# EAGLE design Helicopter Control Board (EAGLE 6.5.1)
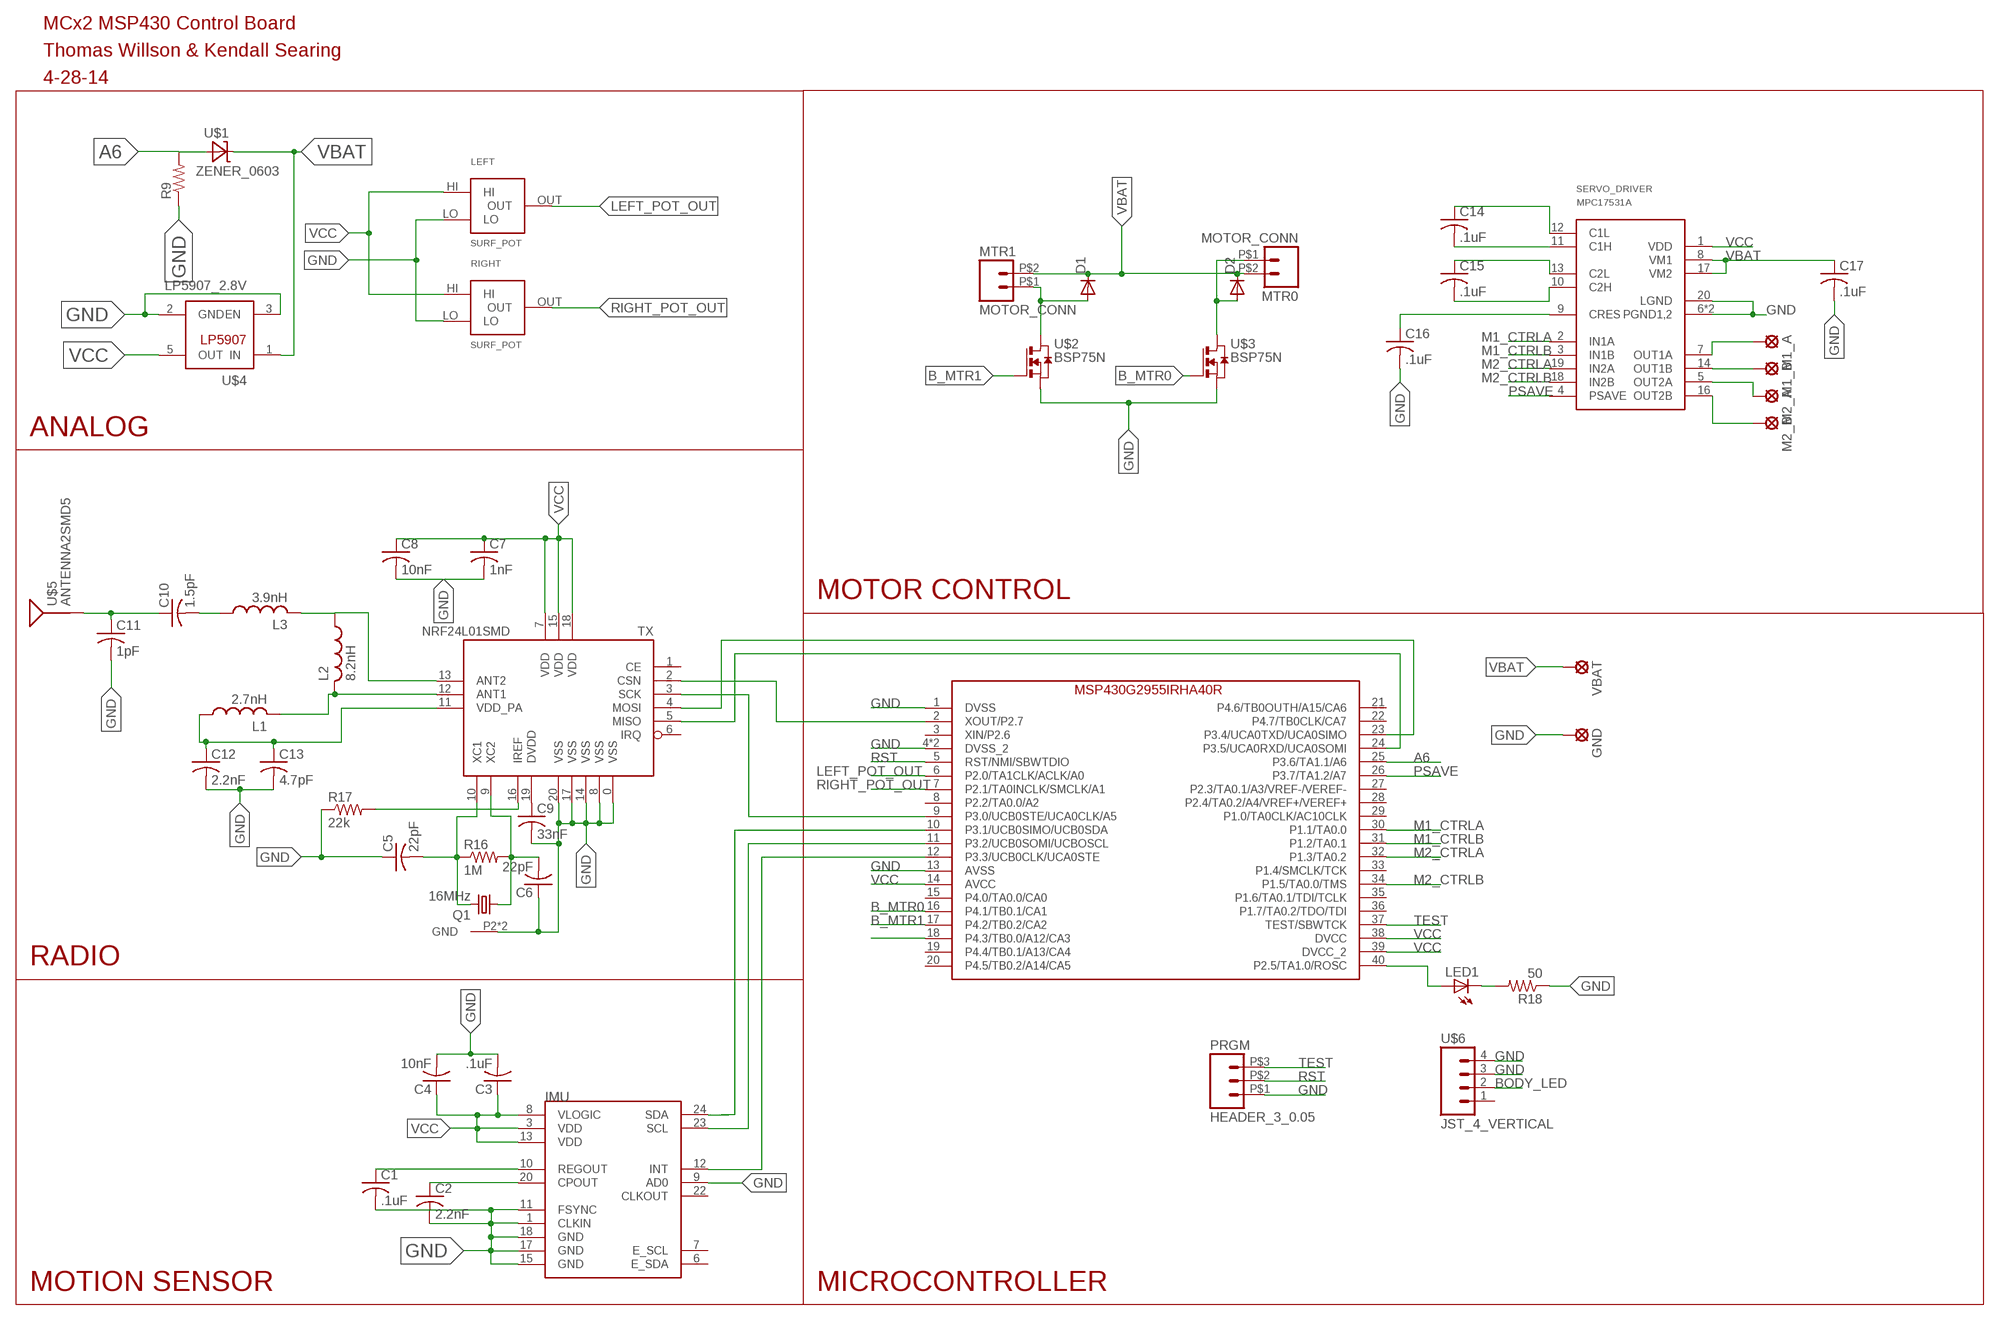
[diagram p0: schematic, sheet 1]

## Parts
C1  .1uF  C-USC0402  [C0402]
C2  2.2nF  C-USC0402  [C0402]
C3  .1uF  C-USC0402  [C0402]
C4  10nF  C-USC0402  [C0402]
C5  22pF  C-USC0402  [C0402]
C6  22pF  C-USC0402  [C0402]
C7  1nF  C-USC0402  [C0402]
C8  10nF  C-USC0402  [C0402]
C9  33nF  C-USC0402  [C0402]
C10  1.5pF  C-USC0402  [C0402]
C11  1pF  C-USC0402  [C0402]
C12  2.2nF  C-USC0402  [C0402]
C13  4.7pF  C-USC0402  [C0402]
C14  .1uF  C-USC0402  [C0402]
C15  .1uF  C-USC0402  [C0402]
C16  .1uF  C-USC0402  [C0402]
C17  .1uF  C-USC0402  [C0402]
D1  DIODESMA  [SMA-DIODE]
D2  DIODESMA  [SMA-DIODE]
GND  LSP10  [LSP10]
IMU  MPU-9150QFN-24-NP  [QFN-24-NP]
L1  2.7nH  L-US  [R0402]
L2  8.2nH  L-US  [R0402]
L3  3.9nH  L-US  [R0402]
LED1  LED-BLUE0603  [LED-0603]
LEFT  SURF_POT  [SURF_POT]
M1_A  LSP10  [LSP10]
M1_B  LSP10  [LSP10]
M2_A  LSP10  [LSP10]
M2_B  LSP10  [LSP10]
MTR0  MOTOR_CONN  [MOTOR_CONN]
MTR1  MOTOR_CONN  [MOTOR_CONN]
PRGM  HEADER_3_0.05  [HEADER_3_.05]
Q1  16MHz  CRYSTAL_16MHZ_12PF_SMD  [TXC-4SMD]
R9  R-US_R0402  [R0402]
R16  1M  R-US_R0402  [R0402]
R17  22k  R-US_R0402  [R0402]
R18  50  R-US_R0603  [R0603]
RIGHT  SURF_POT  [SURF_POT]
SERVO_DRIVER  MPC17531A  [SSOP_20]
TX  NRF24L01SMD  [QFN20]
U$1  ZENER_0603  [ZENER_0603]
U$2  BSP75N  [PG-SOT-223]
U$3  BSP75N  [PG-SOT-223]
U$4  LP5907_2.8V  LP5907  [SOT23-DBV]
U$5  ANTENNA2SMD5  [ANTENNA-CHIP5]
U$6  JST_4_VERTICAL  [JST-4-SMD-VERT-1.0MM]
U$8  G2955IRHA40R  [RHA40]
VBAT  LSP10  [LSP10]

## Nets
A6: R9.2 U$1.A U$8.25(P3.6/TA1.1/A6)
B_MTR0: U$3.1(G) U$8.16(P4.1/TB0.1/CA1)
B_MTR1: U$2.1(G) U$8.17(P4.2/TB0.2/CA2)
BODY_LED: U$6.2 U$8.18(P4.3/TB0.0/A12/CA3)
GND: C1.2 C2.2 C3.2 C4.2 C5.1 C6.1 C7.2 C8.2 C9.2 C11.2 C12.2 C13.2 C16.2 C17.2 GND.MP IMU.1(CLKIN) IMU.9(AD0) IMU.11(FSYNC) IMU.15(GND) IMU.17(GND) IMU.18(GND) LEFT.LO PRGM.P$1 Q1.P2(GND) Q1.P4(GND) R9.1 R17.1 R18.1 RIGHT.LO SERVO_DRIVER.6(PGND1,2) SERVO_DRIVER.15(PGND1,2) SERVO_DRIVER.20(LGND) TX.0(VSS) TX.8(VSS) TX.14(VSS) TX.17(VSS) TX.20(VSS) U$2.3(S) U$2.4(S) U$3.3(S) U$3.4(S) U$4.2(GND) U$4.3(EN) U$6.3 U$6.4 U$8.1(DVSS) U$8.4(DVSS_2) U$8.13(AVSS) U$8.TP(DVSS_2)
LEFT_POT_OUT: LEFT.OUT U$8.6(P2.0/TA1CLK/ACLK/A0)
M1_CTRLA: SERVO_DRIVER.2(IN1A) U$8.30(P1.1/TA0.0)
M1_CTRLB: SERVO_DRIVER.3(IN1B) U$8.31(P1.2/TA0.1)
M2_CTRLA: SERVO_DRIVER.19(IN2A) U$8.32(P1.3/TA0.2)
M2_CTRLB: SERVO_DRIVER.18(IN2B) U$8.34(P1.5/TA0.0/TMS)
N$1: M1_A.MP SERVO_DRIVER.7(OUT1A)
N$3: M1_B.MP SERVO_DRIVER.14(OUT1B)
N$4: TX.3(SCK) U$8.9(P3.0/UCB0STE/UCA0CLK/A5)
N$5: TX.4(MOSI) U$8.23(P3.4/UCA0TXD/UCA0SIMO)
N$6: TX.5(MISO) U$8.24(P3.5/UCA0RXD/UCA0SOMI)
N$7: M2_A.MP SERVO_DRIVER.5(OUT2A)
N$8: IMU.12(INT) U$8.12(P3.3/UCB0CLK/UCA0STE)
N$9: IMU.23(SCL) U$8.11(P3.2/UCB0SOMI/UCBOSCL)
N$10: C1.1 IMU.10(REGOUT)
N$11: C2.1 IMU.20(CPOUT)
N$12: M2_B.MP SERVO_DRIVER.16(OUT2B)
N$13: C14.1 SERVO_DRIVER.12(C1L)
N$14: C14.2 SERVO_DRIVER.11(C1H)
N$15: C15.1 SERVO_DRIVER.13(C2L)
N$17: C10.2 L3.1
N$18: D1.A MTR1.P$1 U$2.2(D)
N$19: D2.A MTR0.P$1 U$3.2(D)
N$20: IMU.24(SDA) U$8.10(P3.1/UCB0SIMO/UCB0SDA)
N$21: C6.2 Q1.P1 R16.2
N$22: C5.2 Q1.P3 R16.1 TX.10(XC1)
N$23: C9.1 TX.19(DVDD)
N$24: R17.2 TX.16(IREF)
N$25: L1.2 L2.2 TX.12(ANT1)
N$26: C12.1 C13.1 L1.1 TX.11(VDD_PA)
N$27: L2.1 L3.2 TX.13(ANT2)
N$28: C10.1 C11.1 U$5.FEED(SIGNAL)
N$29: TX.2(CSN) U$8.2(XOUT/P2.7)
N$30: C15.2 SERVO_DRIVER.10(C2H)
N$31: LED1.A U$8.40(P2.5/TA1.0/ROSC)
N$32: LED1.C R18.2
N$33: C16.1 SERVO_DRIVER.9(CRES)
PSAVE: SERVO_DRIVER.4(PSAVE) U$8.26(P3.7/TA1.2/A7)
RIGHT_POT_OUT: RIGHT.OUT U$8.7(P2.1/TA0INCLK/SMCLK/A1)
RST: PRGM.P$2 U$8.5(RST/NMI/SBWTDIO)
TEST: PRGM.P$3 U$8.37(TEST/SBWTCK)
VBAT: C17.1 D1.C D2.C MTR0.P$2 MTR1.P$2 SERVO_DRIVER.8(VM1) SERVO_DRIVER.17(VM2) U$1.C U$4.1(IN) VBAT.MP
VCC: C3.1 C4.1 C7.1 C8.1 IMU.3(VDD) IMU.8(VLOGIC) IMU.13(VDD) LEFT.HI RIGHT.HI SERVO_DRIVER.1(VDD) TX.7(VDD) TX.15(VDD) TX.18(VDD) U$4.5(OUT) U$8.14(AVCC) U$8.38(DVCC) U$8.39(DVCC_2)
Unconnected: IMU.6(E_SDA) IMU.7(E_SCL) IMU.22(CLKOUT) TX.1(CE) TX.6(IRQ) TX.9(XC2) U$6.1 U$8.3(XIN/P2.6) U$8.8(P2.2/TA0.0/A2) U$8.15(P4.0/TA0.0/CA0) U$8.19(P4.4/TB0.1/A13/CA4) U$8.20(P4.5/TB0.2/A14/CA5) U$8.21(P4.6/TB0OUTH/A15/CA6) U$8.22(P4.7/TB0CLK/CA7) U$8.27(P2.3/TA0.1/A3/VREF-/VEREF-) U$8.28(P2.4/TA0.2/A4/VREF+/VEREF+) U$8.29(P1.0/TA0CLK/AC10CLK) U$8.33(P1.4/SMCLK/TCK) U$8.35(P1.6/TA0.1/TDI/TCLK) U$8.36(P1.7/TA0.2/TDO/TDI)

## Notes on the sheet
- MCx2 MSP430 Control Board
- Thomas Willson & Kendall Searing
- 4-28-14
- ANALOG
- MOTOR CONTROL
- RADIO
- MOTION SENSOR | MICROCONTROLLER

## Library data of the parts
C1-C17 = resistor:C-US: CAPACITOR, American symbol
D1 D2 = SparkFun-DiscreteSemi:DIODE: Diode These are standard reverse protection diodes and small signal diodes. SMA package can handle up to about 1A. SOD-323 can handle about 200mA. What the SOD-323 package when ordering, there are some mfgs out there that are 5-pin packages.
GND M1_A M1_B M2_A M2_B VBAT = solpad:LSP10: SOLDER PAD drill 1.0 mm, distributor Buerklin, 12H555
IMU = SparkFun-Sensors:MPU-9150: 9DOF (3mag, 3accel, 3rotat). I2C interface.
L1-L3 = resistor:L-US: INDUCTOR, American symbol
LED1 = SparkFun-LED:LED-BLUE: Blue LEDs for production use Various blue LEDs stocked by SparkFun production 0603 - DIO-08575 Rebel - DIO-09553 1206 - DIO-09911; PROD_ID: DIO-08575; VALUE: BLUE
LEFT RIGHT = CPE329:SURF_POT
MTR0 MTR1 = CPE329:MOTOR_CONN
PRGM = CPE329:HEADER_3_0.05
Q1 = CPE329:CRYSTAL_16MHZ_12PF_SMD: 887-1723-1-ND
R9 R16-R18 = resistor:R-US_: RESISTOR, American symbol
SERVO_DRIVER = freescale:MPC17531A
TX = SparkFun-RF:NRF24L01: 2.4GHz Low Power Transceiver This is the very popular, low cost, very low power RF transceiver from Nordic Semiconductor. Simple SPI interface. SKU: COM-00690
U$1 = formula electric:ZENER_0603
U$2 U$3 = infineon:BSP75N
U$4 = texas:LP5907
U$5 = SparkFun-RF:ANTENNA2: Chip antenna Single endded antenna. Common with smaller chip antennas. CHIP4 package is the GPS Chip Antenna SKU: GPS-08418. CHIP5 package is 2.4GHz chip antenna SKU: WRL-00144.
U$6 = SparkFun-Connectors:JST_4_VERTICAL: CONN HEADER SH 4POS TOP 1MM TIN DK: 455-1790-1-ND
U$8 = TI_MSP430_v16:G2955IRHA40R

## Board
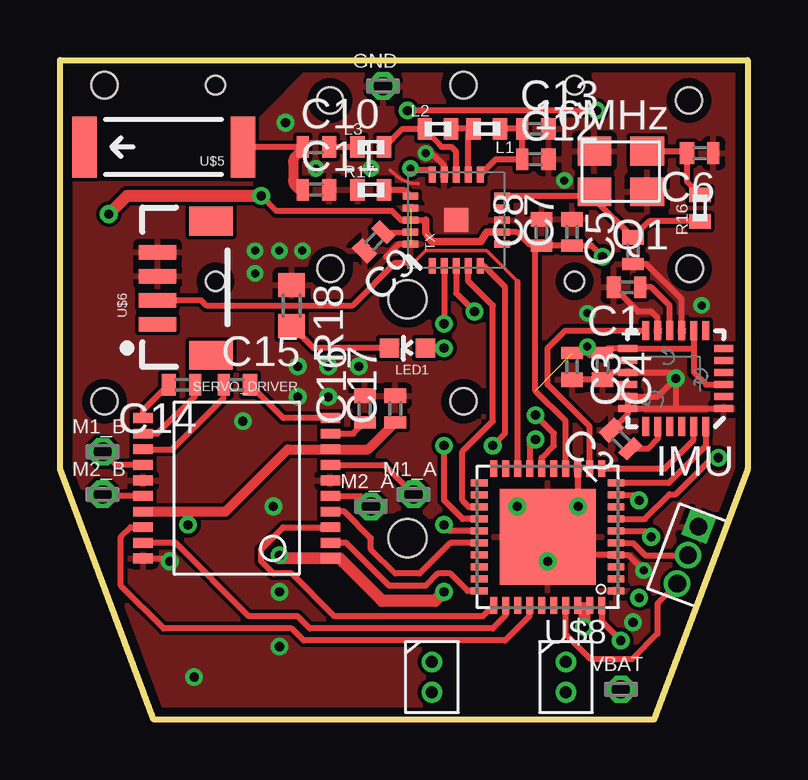
[diagram p1: board, top side]
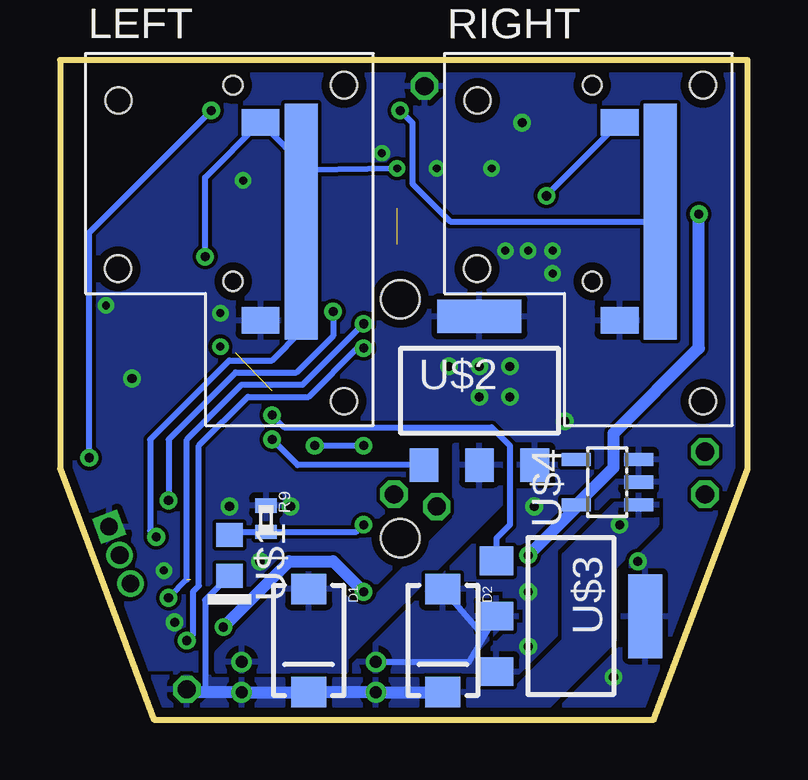
[diagram p2: board, bottom side, seen from below]

Size 28.65 x 27.51 mm. Coordinates in mm from the lower left corner, seen from the top.
Outline: 3.91,0 0,10.46 0,27.51 28.65,27.51 28.65,10.46 24.74,0 3.91,0
Copper layers (1*16): Top 0.0356mm / dielectric 1.5011mm / Bottom 0.0356mm
Design rules "OshPark DRC": minimum track width 6mil, minimum drill 13mil, track to track 6mil, track to pad 6mil, pad to pad 6mil, via to via 6mil, smd to smd 6mil, copper to edge 15mil, drill to drill 6mil, minimum pad ring 7mil, minimum via ring 7mil, stop-mask expansion 3mil, vias tented up to drill 0mil, thermal gap 10mil
Holes 1.6 mm at 14.48,17.53 14.48,7.57
tRestrict: 2 lines

### Footprints (pad centres in the part's own frame; a part is rotated, then mirrored left to right if it is on the bottom)
C0402 = smd 0.5 x 0.9: 1 -0.55,0 | smd 0.6 x 0.9: 2 0.55,0
SMA-DIODE = smd 1.27 x 1.47: A -2.15,0; C 2.15,0
LSP10 = drill 0.762 octagon: MP 0,0
QFN-24-NP = smd 0.8 x 0.3: 1 -2,1.25; 2 -2,0.75; 3 -2,0.25; 4 -2,-0.25; 5 -2,-0.75; 6 -2,-1.25; 13 2,-1.25; 14 2,-0.75; 15 2,-0.25; 16 2,0.25; 17 2,0.75; 18 2,1.25 | smd 0.3 x 0.8: 7 -1.25,-2; 8 -0.75,-2; 9 -0.25,-2; 10 0.25,-2; 11 0.75,-2; 12 1.25,-2; 19 1.25,2; 20 0.75,2; 21 0.25,2; 22 -0.25,2; 23 -0.75,2; 24 -1.25,2
R0402 = smd 0.6 x 0.9: 1 -0.55,0; 2 0.55,0
LED-0603 = smd 0.8 x 0.8: A 0,-0.75; C 0,0.75
SURF_POT = smd 1.575 x 1.092: HI -1.702,4.128; LO -1.702,-4.128 | smd 1.372 x 9.83: OUT 0,0 | hole 1.092: 1.778,5.677; -7.62,5.042; 1.778,-7.493; -7.645,-1.968 | hole 0.787: -2.845,5.677; -2.845,-2.502
MOTOR_CONN = drill 0.5 pad 0.813: P$1 -0.635,0; P$2 0.635,0
HEADER_3_.05 = drill 0.737 pad 1.067 square: P$1 -1.27,0 | drill 0.737 pad 1.067: P$2 0,0; P$3 1.27,0
TXC-4SMD = smd 1.4 x 1.2: P1 -1.1,-0.85; P2 1.1,-0.85; P3 1.1,0.85; P4 -1.1,0.85
R0603 = smd 1 x 1.1: 1 -0.85,0; 2 0.85,0
SSOP_20 = smd 0.813 x 0.406: 1 -3.9,2.925; 2 -3.9,2.275; 3 -3.9,1.625; 4 -3.9,0.975; 5 -3.9,0.325; 6 -3.9,-0.325; 7 -3.9,-0.975; 8 -3.9,-1.625; 9 -3.9,-2.275; 10 -3.9,-2.925; 11 3.9,-2.925; 12 3.9,-2.275; 13 3.9,-1.625; 14 3.9,-0.975; 15 3.9,-0.325; 16 3.9,0.325; 17 3.9,0.975; 18 3.9,1.625; 19 3.9,2.275; 20 3.9,2.925
QFN20 = smd 1 x 1: 0 0,0 | smd 0.65 x 0.3: 1 -1.9,1; 2 -1.9,0.5; 3 -1.9,0; 4 -1.9,-0.5; 5 -1.9,-1; 11 1.9,-1; 12 1.9,-0.5; 13 1.9,0; 14 1.9,0.5; 15 1.9,1 | smd 0.3 x 0.65: 6 -1,-1.9; 7 -0.5,-1.9; 8 0,-1.9; 9 0.5,-1.9; 10 1,-1.9; 16 1,1.9; 17 0.5,1.9; 18 0,1.9; 19 -0.5,1.9; 20 -1,1.9
ZENER_0603 = smd 1 x 1.1: A -0.85,0; C 0.85,0
PG-SOT-223 = smd 1.2 x 1.4: 1 -2.311,-3.099; 2 0,-3.099; 3 2.311,-3.099 | smd 3.5 x 1.4: 4 0,3.099
SOT23-DBV = smd 0.55 x 1.2: 1 -0.95,-1.3; 2 0,-1.3; 3 0.95,-1.3; 4 0.95,1.3; 5 -0.95,1.3
ANTENNA-CHIP5 = smd 1.016 x 2.54: FEED -3.302,0; NC 3.302,0
JST-4-SMD-VERT-1.0MM = smd 0.6 x 1.55: 1 -1.54,1.27; 2 -0.54,1.27; 3 0.46,1.27; 4 1.46,1.27 | smd 1.2 x 1.8: P$1 -2.84,-0.955; P$2 2.76,-0.955
RHA40 = smd 0.7 x 0.3: 1 -2.85,2.25; 2 -2.85,1.75; 3 -2.85,1.25; 4 -2.85,0.75; 5 -2.85,0.25; 6 -2.85,-0.25; 7 -2.85,-0.75; 8 -2.85,-1.25; 9 -2.85,-1.75; 10 -2.85,-2.25; 21 2.85,-2.25; 22 2.85,-1.75; 23 2.85,-1.25; 24 2.85,-0.75; 25 2.85,-0.25; 26 2.85,0.25; 27 2.85,0.75; 28 2.85,1.25; 29 2.85,1.75; 30 2.85,2.25 | smd 0.3 x 0.7: 11 -2.25,-2.85; 12 -1.75,-2.85; 13 -1.25,-2.85; 14 -0.75,-2.85; 15 -0.25,-2.85; 16 0.25,-2.85; 17 0.75,-2.85; 18 1.25,-2.85; 19 1.75,-2.85; 20 2.25,-2.85; 31 2.25,2.85; 32 1.75,2.85; 33 1.25,2.85; 34 0.75,2.85; 35 0.25,2.85; 36 -0.25,2.85; 37 -0.75,2.85; 38 -1.25,2.85; 39 -1.75,2.85; 40 -2.25,2.85 | smd 4 x 4: TP 0,0

### Placement (x,y rotation side)
C1  23.62,18.03 180 top
C2  23.37,11.68 135 top
C3  21.34,14.73 270 top
C4  22.61,14.73 270 top
C5  23.88,19.56 90 top
C6  26.67,23.62 180 top
C7  21.34,20.32 90 top
C8  20.07,20.32 90 top
C9  13.08,19.94 225 top
C10  10.67,23.88 0 top
C11  10.67,22.1 0 top
C12  19.81,23.37 0 top
C13  19.81,24.64 0 top
C14  5.08,13.97 180 top
C15  7.37,13.97 0 top
C16  12.7,12.95 90 top
C17  13.97,12.95 90 top
D1  18.29,3.3 270 bottom
D2  12.7,3.3 270 bottom
GND  13.46,26.42 0 top
IMU  25.65,14.22 180 top
L1  17.78,24.64 180 top
L2  15.75,24.64 0 top
L3  12.95,23.88 0 top
LED1  14.48,15.49 90 top
LEFT  18.59,20.78 0 bottom
M1_A  14.73,9.4 0 top
M1_B  1.78,11.18 0 top
M2_A  12.95,8.89 0 top
M2_B  1.78,9.4 0 top
MTR0  15.49,1.78 270 top
MTR1  21.08,1.78 270 top
PRGM  26.16,6.86 249.5 top
Q1  23.37,22.86 180 top
R9  20.07,8.38 270 bottom
R16  26.67,21.34 90 top
R17  12.95,22.1 0 top
R18  9.65,17.27 270 top
RIGHT  3.63,20.78 0 bottom
SERVO_DRIVER  7.37,9.65 180 top
TX  16.51,20.83 90 top
U$1  21.59,6.86 270 bottom
U$2  11.18,13.72 0 bottom
U$3  7.37,4.32 270 bottom
U$4  5.84,9.91 90 bottom
U$5  4.32,23.88 180 top
U$6  5.33,18.03 90 top
U$8  20.32,7.62 180 top
VBAT  23.37,1.27 0 top

### Tracks (layer width: path | path; a pad name or v marks a point on that pad's centre or on a via)
A6  (via drill 0.38)
  Top 0.254: U$8.25 16.26,7.87 v16,8.13
  Bottom 0.254: v16,8.13 16.3,7.83 R9.2 21.47,7.83 U$1.A
B_MTR0  (via drill 0.38)
  Top 0.254: 20.07,10.41 arc90 20.07,10.42 U$8.16 20.07,10.92 20.57,11.43 20.57,11.94 v19.81,12.7
  Bottom 0.254: v19.81,12.7 19.3,12.19 10.67,12.19 9.91,11.43 9.91,8.13 10.46,7.57 U$3.1
B_MTR1  (via drill 0.38)
  Top 0.254: v19.81,11.68 19.57,11.44 U$8.17
  Bottom 0.254: U$2.1 18.75,10.62 v19.81,11.68
BODY_LED
  Top 0.152: 19.07,18.27 17.78,19.56 15.24,19.56 14.73,19.05
  Top 0.254: U$8.18 19.07,18.27 | 14.73,19.05 13.97,19.05 12.19,17.27 6.1,17.27 5.87,17.49 U$6.2
GND  (via drill 0.33, 0.38)  (1 unrouted)
  Top 0.152: 7.62,12.7 v7.62,12.45 | 13.77,22.91 14.05,22.66 14.04,22.67 14.03,22.67 14.24,22.52 14.61,22.38 | 14.64,22.37 14.93,22.35
  Top 0.254: C3.2 C4.2 22.9,14.47 IMU.15 25.4,14.47 v25.65,14.22 | IMU.18 23.65,12.75 C2.2 | IMU.9 25.9,17.53 24.43,19.01 C5.1 | IMU.11 24.9,16.75 24.64,17.02 24.09,17.02 C1.2 | SERVO_DRIVER.20 4.45,6.73 v4.57,6.6 | U$8.13 21.57,8.91 v21.59,8.89 | U$8.TP v20.32,6.6 20.59,6.87 U$8.4 23.67,6.87 v24.32,6.22 | v25.65,14.22 24.9,13.47 IMU.17 IMU.18 | IMU.18 25.65,12.97 | v25.65,14.22 25.65,12.97 | 25.65,12.97 IMU.1 | TX.20 14.11,19.83 13.59,19.3 | TX.14 16.01,23.11 15.62,23.5 v15.24,23.62
  other vias: 5.59,1.78 9.14,3.05 9.14,5.33 12.45,14.73 11.18,14.73 9.91,14.73 9.91,13.46 11.18,13.46 8.89,8.89 9.4,24.89 19.05,8.89 23.88,4.06 10.67,22.99 12.95,22.99 9.14,19.56 8.13,19.56 8.13,18.61 10.1,19.56 26.73,17.27 21.97,16.95 21.02,22.48
  pour Bottom (rank 6): 0,27.69 28.7,27.69 28.7,10.41 24.89,0 3.81,0 0,10.41
  pour Top (rank 6): 0,27.69 28.7,27.69 28.7,10.41 24.89,0 3.81,0 0,10.41
LEFT_POT_OUT  (via drill 0.38)
  Top 0.254: U$8.6 24.39,7.87 v24.64,7.62
  Bottom 0.254: LEFT.OUT 18.59,16.2 19.81,14.99 21.59,14.99 24.89,11.68 24.89,7.87 v24.64,7.62
M1_CTRLA
  Top 0.254: U$8.30 16.98,5.37 16.26,6.1 15.75,6.1 15.24,5.59 13.72,5.59 11.93,7.38 SERVO_DRIVER.2
M1_CTRLB
  Top 0.254: U$8.31 17.62,4.32 11.43,4.32 9.65,6.1 8.89,6.1 8.38,6.6 8.38,7.11 9.3,8.03 SERVO_DRIVER.3
M2_CTRLA
  Top 0.254: U$8.32 18.57,4.35 18.03,3.81 10.41,3.81 9.91,4.32 7.87,4.32 4.82,7.38 SERVO_DRIVER.19
M2_CTRLB
  Top 0.254: SERVO_DRIVER.18 2.95,8.03 2.54,7.62 2.54,5.59 4.32,3.81 9.65,3.81 10.16,3.3 18.54,3.3 19.56,4.32 19.56,4.76 U$8.34
N$1
  Top 0.254: SERVO_DRIVER.7 13.5,10.63 M1_A.MP
N$3
  Top 0.254: SERVO_DRIVER.14 2.33,10.63 M1_B.MP
N$4  (via drill 0.38)
  Top 0.254: U$8.9 23.9,9.37 v24.13,9.14 | TX.3 16.51,17.78 v17.27,17.02
  Bottom 0.254: v17.27,17.02 17.27,16 18.8,14.48 21.34,14.48 24.13,11.68 v24.13,9.14
N$5
  Top 0.254: U$8.23 17.04,8.87 16.76,9.14 16.76,11.18 18.03,12.45 18.03,17.27 17.01,18.3 TX.4
N$6  (via drill 0.38)
  Top 0.254: TX.5 17.65,18.93 18.54,18.03 18.54,11.94 v18.03,11.43 | v16,11.43 16,9.14 16.78,8.37 U$8.24
  Bottom 0.254: v18.03,11.43 v16,11.43
N$7
  Top 0.254: SERVO_DRIVER.5 12.52,9.33 M2_A.MP
N$8
  Top 0.254: U$8.12 22.07,12.22 20.32,13.97 20.32,15.49 21.05,16.22 IMU.12
N$9
  Top 0.254: U$8.11 25.2,10.47 26.4,11.67 IMU.23
N$10
  Top 0.254: IMU.10 25.4,17.27 24.64,18.03 C1.1
N$11
  Top 0.254: IMU.20 24.9,11.7 24.5,11.29 C2.1
N$12
  Top 0.254: SERVO_DRIVER.16 1.85,9.33 M2_B.MP
N$13
  Top 0.254: SERVO_DRIVER.12 4.05,11.93 5.63,13.5 C14.1
N$14
  Top 0.254: SERVO_DRIVER.11 3.47,12.91 C14.2
N$15
  Top 0.254: SERVO_DRIVER.13 4.67,11.28 6.82,13.42 C15.1
N$17
  Top 0.254: L3.1 C10.2
N$18
  Bottom 0.254: D1.A 17.9,5.33
  pour Bottom: 16.76,2.03 22.1,2.03 22.1,2.79 18.8,6.1 17.78,6.1 16.51,4.83 15.75,4.83 12.19,8.38 12.19,11.43 10.16,11.43 10.16,9.14 16.76,2.54
N$19
  Bottom 0.254: MTR0.P$1 11.61,2.41 U$3.2 11.06,3.56 D2.A
  pour Bottom (rank 2): 9.65,3.81 10.41,3.81 11.43,2.79 11.43,2.03 16.51,2.03 16.51,2.54 12.95,6.1 12.19,6.1 11.18,5.08 9.65,5.08
N$20
  Top 0.254: IMU.24 26.9,11.41 25.36,9.87 U$8.10
N$21
  Top 0.254: Q1.P1 26.03,23.71 C6.2 26.12,22.44 R16.2
N$22
  Top 0.254: R16.1 24.55,20.79 C5.2 22.27,21.72 Q1.P3 22.09,21.83 TX.10
N$23
  Top 0.254: C9.1 TX.19
N$24
  Top 0.254: R17.2 14.34,22.1 TX.16
N$25
  Top 0.254: L2.2 L1.2 17.01,24.42 TX.12
N$26
  Top 0.254: TX.11 18.15,23.37 C12.1 C13.1 L1.1
N$27
  Top 0.254: L3.2 14.27,24.64 L2.1 15.9,23.88 16.32,23.88 16.51,23.69 TX.13
N$28
  Top 0.254: U$5.FEED C10.1 10.12,23.77
  Top 0.406: 10.12,23.77 10.12,23.64 arc90 9.72,23.24 9.72,22.5 arc90 C11.1
N$29  (via drill 0.38)  (1 unrouted)
  Top 0.254: TX.2 v16,16.51 | U$8.2 23.2,5.84
  Bottom 0.254: v16,16.51 18.54,13.97 21.08,13.97 23.37,11.68 23.37,5.84 v24.13,5.08
N$30
  Top 0.254: SERVO_DRIVER.10 9.31,12.58 C15.2
N$31  (via drill 0.38)
  Top 0.254: v16,15.49 LED1.A | U$8.40 22.57,4.1 v23.37,3.3
  Bottom 0.254: v16,15.49 16.26,15.49 18.29,13.46 20.83,13.46 22.86,11.43 22.86,5.59 23.11,5.33 23.11,3.56 v23.37,3.3
N$32
  Top 0.254: LED1.C 10.58,15.49 R18.2
N$33
  Top 0.254: SERVO_DRIVER.9 12.22,11.93 C16.1
PSAVE
  Top 0.254: U$8.26 16.26,7.37 14.99,6.1 13.97,6.1 12.95,7.11 12.95,7.57 11.85,8.68 SERVO_DRIVER.4
RIGHT_POT_OUT  (via drill 0.38)
  Top 0.254: U$8.7 24.37,8.37 25.4,9.4 25.65,9.4 27.18,10.92 v27.43,10.92 | v22.35,25.4 v14.48,25.4
  Bottom 0.254: v27.43,10.92 27.43,20.32 v22.35,25.4 | RIGHT.OUT 12.39,20.78 13.97,22.35 13.97,24.89 v14.48,25.4
RST
  Top 0.254: U$8.5 23.87,7.37 24.38,6.86 PRGM.P$2
TEST
  Top 0.254: U$8.37 21.07,3.57 22.1,2.54 23.86,2.54 24.89,3.57 24.89,4.84 PRGM.P$3
VBAT  (via drill 0.38)
  Top 0.406: C17.1 12.84,11.28 SERVO_DRIVER.8 9.5,11.28 6.9,8.68 5.33,8.68 | SERVO_DRIVER.17 5.33,8.68 | v5.33,8.13 5.33,8.68
  Bottom 0.254: U$1.C 22.61,4.99 22.61,1.27 VBAT.MP
  Bottom 0.508: D2.C MTR0.P$2 D1.C MTR1.P$2 23.24,1.14 VBAT.MP
  pour Bottom (rank 3): 3.81,9.4 3.81,8.13 5.59,6.35 5.59,3.3 8.89,0 24.64,0 25.4,1.78 11.43,1.78 11.43,1.27 9.65,1.27 7.62,3.3 7.62,6.86 5.08,9.4
VCC  (via drill 0.33, 0.38)  (1 unrouted)
  Top 0.254: C8.1 C7.1 22.14,19.77 v22.61,19.3 | C8.1 20.02,19.81 19.56,19.81 19.04,20.33 TX.7 18.03,20.33 | IMU.8 26.42,16.21 26.42,15.49 | 26.42,15.49 26.42,14.48 26.92,13.97 IMU.3 | 26.42,15.49 26.4,15.47 IMU.13 22.8,15.47 C4.1 22.1,15.28 C3.1 | TX.15 15.51,22.91 14.92,22.92 v14.61,22.99 | 15.24,20.83 TX.18 14.22,20.83 13.84,21.21 9.02,21.21 v8.38,21.84 | U$8.39 U$8.38 21.84,4.5 | C8.1 19.81,19.52 19.81,13.72 21.07,12.46 U$8.14
  Top 0.305: 18.03,20.33 17.79,20.33 17.53,19.94 15.49,19.94 15.24,20.32 15.24,20.83
  Top 0.406: v21.97,15.56 22.1,15.43 22.1,15.28
  Top 0.508: 21.84,4.5 v21.84,3.86 | v2.03,21.08 2.79,21.84 v8.38,21.84 | v9.14,6.86 9.28,6.73 SERVO_DRIVER.1 11.65,6.73 13.42,4.95 15.62,4.95 v16,5.33
  Bottom 0.254: RIGHT.HI 8.38,21.86 v8.38,21.84 | v22.61,19.3 22.61,22.61 20.31,24.91 LEFT.HI 18.31,22.92 v14.61,22.99
  Bottom 0.508: v2.03,21.08 2.03,15.49 5.59,11.94 5.59,10.51 U$4.5 7.14,8.86 v9.14,6.86 | v16,5.33 17.27,6.6 19.1,6.6 v21.84,3.86